# EasyEDA Pro project course_project_bulid.eprj

# Schematic Schematic1
Create Date: 2023-01-06; Page Name: P1; Project Name: course_project_bulid; Schematic Name: Schematic1; Update Date: 2023-01-06; Company: 嘉立创EDA; Page Size: A4; Version: V1.0
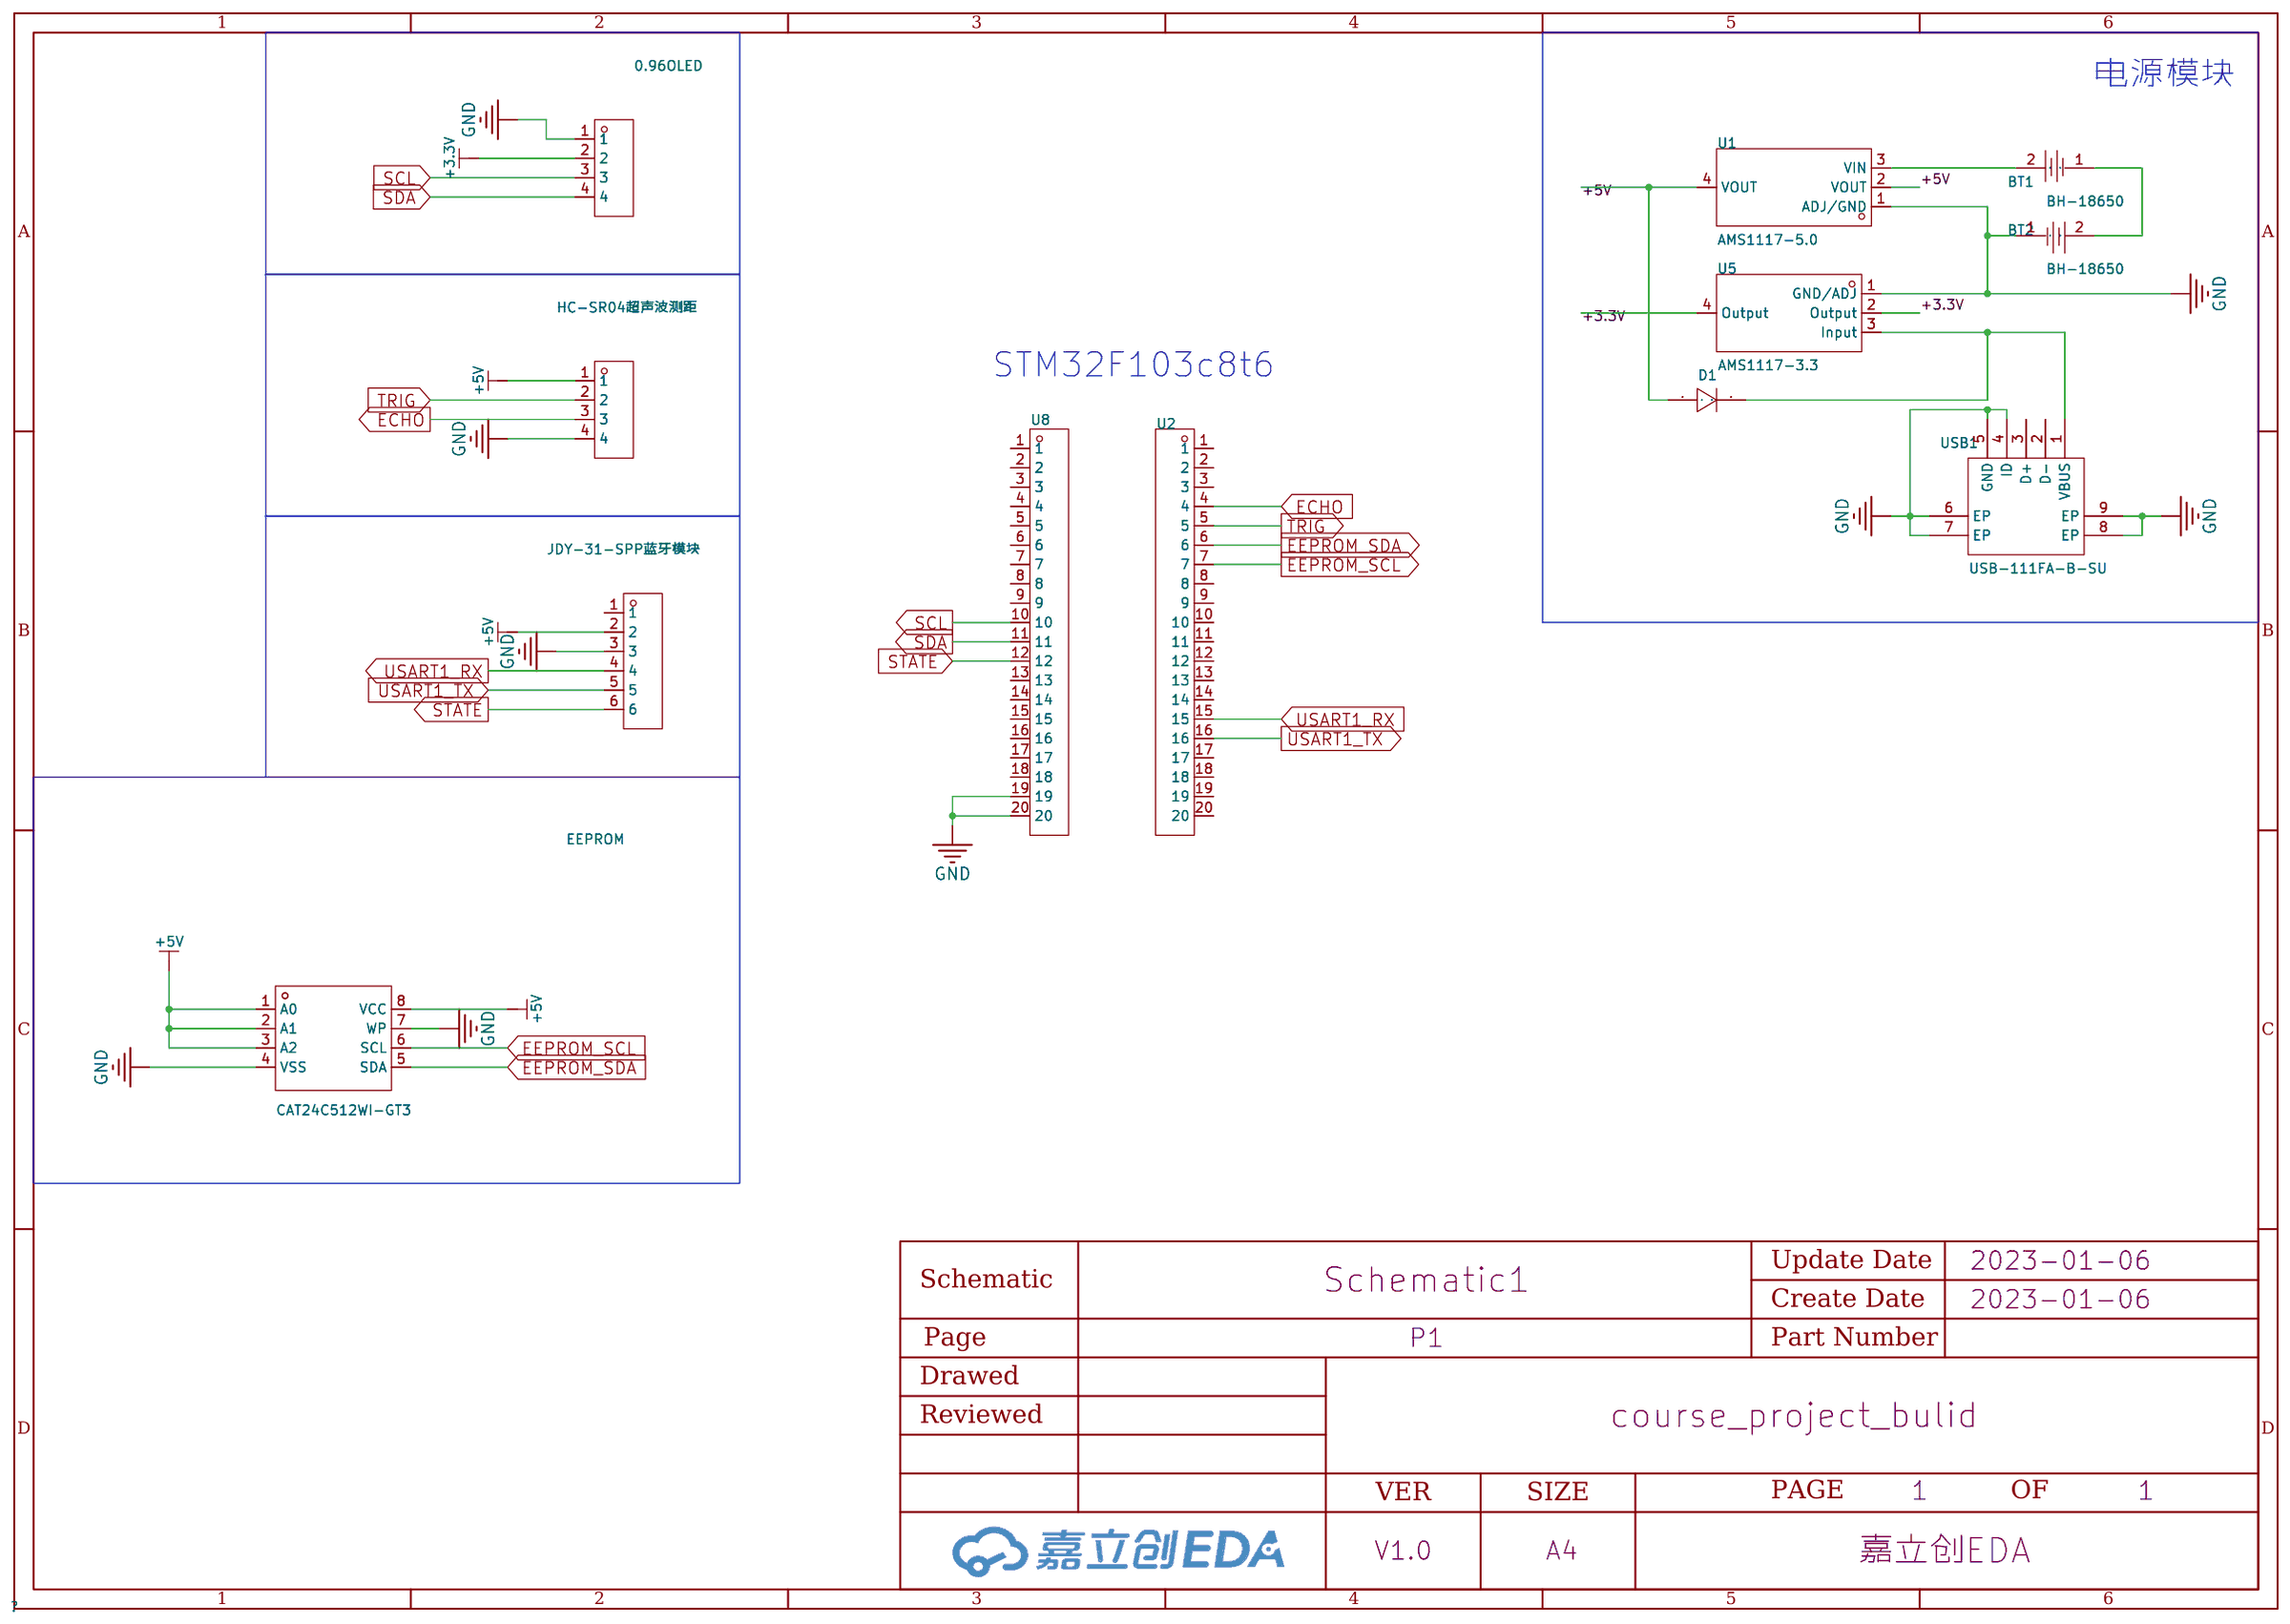
[diagram p0: schematic sheet]

## Parts
BT1  BH-18650  [BATTERY-SMD_18650-1S-L77.1-W20.7-1]
BT2  BH-18650  [BATTERY-SMD_18650-1S-L77.1-W20.7-1]
D1  1N4148WS  [SOD-323_L1.8-W1.3-LS2.5-RD]
EEPROM  CAT24C512WI-GT3  [SOIC-8_L4.9-W3.9-P1.27-LS6.0-BL]
HC-SR04超声波测距  PM254-1-04-W-8.5  [HDR-TH_4P-P2.54-H-F-W10.0-N]
JDY-31-SPP蓝牙模块  PM254-1-06-W-8.5  [HDR-TH_6P-P2.54-H-F-W10.0-N]
U1  AMS1117-5.0  [SOT-223-3_L6.5-W3.4-P2.30-LS7.0-BR]
U2  X5511FV-20-C30D97-0970  [HDR-TH_20P-P2.54-V-F]
U3  0.96OLED  [HDR-TH_4P-P2.54-V-F]
U5  AMS1117-3.3  [SOT-223-4_L6.5-W3.5-P2.30-LS7.0-BR]
U8  X5511FV-20-C30D97-0970  [HDR-TH_20P-P2.54-V-F]
USB1  USB-111FA-B-SU  [USB-SMD_USB-111FA-B-SU]

## Library data of the parts
BT1 BT2 = BH-18650-B1BA002: LCSC Part Name: 电池盒BH-18650; Supplier Part: C2988620; Manufacturer: MYOUNG(美阳); Supplier Footprint: SMD; JLCPCB Part Class: Extended Part; Datasheet: https://atta.szlcsc.com/upload/public/pdf/source/20220402/870DB99AB50CA0DF8D51CF7C86A51FAB.pdf; Supplier: LCSC
D1 = 1N4148WS_C2128: 二极管配置:独立式;功率:200mW;直流反向耐压(Vr):100V;平均整流电流(Io):150mA;正向压降(Vf):1.25V@150mA;反向电流(Ir):1uA@75V;反向恢复时间(trr):4ns;工作温度:+150℃@(Tj);; LCSC Part Name: 100V 150mA 4ns T4; Supplier Part: C2128; Manufacturer: CJ(江苏长电/长晶); Supplier Footprint: SOD-323; JLCPCB Part Class: Basic Part; Datasheet: https://atta.szlcsc.com/upload/public/pdf/source/20140809/1457707208178.pdf; Supplier: LCSC; Diode Configuration: 独立式; Power Dissipation: 200mW; Reverse Voltage (Vr): 100V; Average Rectified Current (Io): 150mA; Forward Voltage (Vf@If): 1.25V@150mA; Reverse Leakage Current: 1uA@75V; Reverse Recovery Time (trr): 4ns; Operating Temperature: +150℃@(Tj)
EEPROM = CAT24C512WI-GT3: CAT24C512 是一款 EEPROM 串行 512-Kb I2C，内部组织为 65,536 个词，每个词 8 位。它具有 128 字节页写入缓存，支持标准 (100 kHz)、快速 (400 kHz) 和超快 (1 MHz) I2C 协议。写入操作可通过将 WP 引脚置于高电平类禁止（这样会保护整个内存）。外部地址引脚使其能够在同一个总线上放置最多八个 CAT24C512 器件。片上 ECC（错误修正代码）使得该器件适用于高可靠性应用。; LCSC Part Name: EEPROM 串行 512-Kb I2C; Supplier Part: C79986; Manufacturer: onsemi(安森美); Supplier Footprint: SOIC-8; JLCPCB Part Class: Extended Part; Datasheet: https://atta.szlcsc.com/upload/public/pdf/source/20160729/1469779584598.PDF; Supplier: LCSC
HC-SR04超声波测距 = PM254-1-04-W-8.5: 间距:2.54mm;总孔位数:4;排数:1;插孔结构:1x4P;行距:-;安装类型:弯插;圆孔/方孔:方孔;额定电流:3A;额定电压:-;插孔方向:侧面;塑高:8.5mm;工作温度范围:-40℃~+105℃;; LCSC Part Name: 2.54mm 1x4P; Supplier Part: C2897386; Manufacturer: HCTL(华灿天禄); Supplier Footprint: 弯插,P=2.54mm; JLCPCB Part Class: Extended Part; Datasheet: https://atta.szlcsc.com/upload/public/pdf/source/20211019/10E5F374A8C70BEE256048F5DCDE14A3.pdf; Supplier: LCSC; Pitch: 2.54mm; Number of Holes: 4; Number of Rows: 1; Holes Structure: 1x4P; Mounting Type: 弯插; Circular Hole / Square Hole: 方孔; Current Rating (Max): 3A; Holes Direction: 侧面; Insulation Height: 8.5mm; Operating Temperature Range: -40℃~+105℃
JDY-31-SPP蓝牙模块 = PM254-1-06-W-8.5: 间距:2.54mm;总孔位数:6;排数:1;插孔结构:1x6P;行距:-;安装类型:弯插;圆孔/方孔:方孔;额定电流:3A;额定电压:-;插孔方向:侧面;塑高:8.5mm;工作温度范围:-40℃~+105℃;; LCSC Part Name: 2.54mm 1x6P; Supplier Part: C2897388; Manufacturer: HCTL(华灿天禄); Supplier Footprint: 弯插,P=2.54mm; JLCPCB Part Class: Extended Part; Datasheet: https://atta.szlcsc.com/upload/public/pdf/source/20211019/10E5F374A8C70BEE256048F5DCDE14A3.pdf; Supplier: LCSC; Pitch: 2.54mm; Number of Holes: 6; Number of Rows: 1; Holes Structure: 1x6P; Mounting Type: 弯插; Circular Hole / Square Hole: 方孔; Current Rating (Max): 3A; Holes Direction: 侧面; Insulation Height: 8.5mm; Operating Temperature Range: -40℃~+105℃
U1 = AMS1117-5.0_C2909825: 输出类型:固定;输出极性:正;输出通道数:1;最大输入电压:20V;输出电压:5V;压差:1.4V@1A;静态电流(地电流):5mA;输出电流:1A;电源纹波抑制比(PSRR):70dB@(120Hz);噪声:0.003%Vout;特性:大电流;工作温度:-40℃~+125℃@(Tj);; LCSC Part Name: 正 Vin=20V Vout=5V 1A 70dB@(120Hz); Supplier Part: C2909825; Manufacturer: WPMtek(维攀微); Supplier Footprint: SOT-223-3; JLCPCB Part Class: Extended Part; Datasheet: https://atta.szlcsc.com/upload/public/pdf/source/20211021/A68CA558078DAC4BBD2162BCADCC35AB.pdf; Supplier: LCSC; Output Type: 固定; Output Polarity: 正; Number of Outputs: 1; Maximum Input Voltage: 20V; Output Voltage: 5V; Dropout Voltage: 1.4V@1A; Quiescent Current (Ground Current): 5mA; Output Current: 1A; Power Supply Rejection Ratio (PSRR): 70dB@(120Hz); Noise: 0.003%Vout; Feature: 大电流; Operating Temperature: -40℃~+125℃@(Tj)
U2 U8 = X5511FV-20-C30D97-0970: 间距:2.54mm;总孔位数:20;排数:1;插孔结构:1x20P;行距:-;安装类型:直插;圆孔/方孔:圆孔;额定电流:-;额定电压:-;插孔方向:顶部;塑高:3mm;触头材质:黄铜;触头镀层:金;工作温度范围:-40℃~+105℃;焊接温度(最大值):260℃;; LCSC Part Name: 2.54mm 1x20P; Supplier Part: C2883486; Manufacturer: XKB Connectivity(中国星坤); Supplier Footprint: 直插,P=2.54mm; JLCPCB Part Class: 扩展库; Datasheet: https://atta.szlcsc.com/upload/public/pdf/source/20211009/43EC1C49F931A7FEC57CD081BD1C4E7E.pdf; Supplier: LCSC; Pitch: 2.54mm; Number of Holes: 20; Number of Rows: 1; Holes Structure: 1x20P; Mounting Type: 直插; Circular Hole / Square Hole: 圆孔; Holes Direction: 顶部; Insulation Height: 3mm; Contact Material: 黄铜; Contact Plating: 金; Operating Temperature Range: -40℃~+105℃; Welding Temperature (Max): 260℃
U3 = A2541HWV-4P_C5176037: LCSC Part Name: A2541HWV-4P; Supplier Part: C5176037; Manufacturer: CJT(长江连接器); Supplier Footprint: 插件,P=2.54mm; Datasheet: https://atta.szlcsc.com/upload/public/pdf/source/20220916/7A4096DE70FDAC144DF90D6CBDE9C2A1.pdf; Supplier: LCSC
U5 = AMS1117-3.3_C369933: 输出类型:固定;输出极性:正;输出通道数:1;最大输入电压:18V;输出电压:3.3V;压差:1.3V@800mA;静态电流(地电流):8mA;输出电流:1A;电源纹波抑制比(PSRR):-;噪声:-;特性:-;工作温度:-;; LCSC Part Name: 正 Vin=18V Vout=3.3V 1A; Supplier Part: C369933; Manufacturer: KEXIN(科信); Supplier Footprint: SOT-223-4; JLCPCB Part Class: Extended Part; Datasheet: https://atta.szlcsc.com/upload/public/pdf/source/20190724/C369933_94137CB0CFA8D6ABD8E5DA714A2C2C4B.pdf; Supplier: LCSC; Output Type: 固定; Output Polarity: 正; Number of Outputs: 1; Maximum Input Voltage: 18V; Output Voltage: 3.3V; Dropout Voltage: 1.3V@800mA; Quiescent Current (Ground Current): 8mA; Output Current: 1A
USB1 = USB-111FA-B-SU: mirco usb连接器 USB-111FA-B-SU B型 5.06*7.5*2; LCSC Part Name: mirco usb连接器 USB-111FA-B-SU B型; Supplier Part: C2939563; Manufacturer: HOOYA(皓宇电子); Supplier Footprint: SMD; JLCPCB Part Class: Extended Part; Datasheet: https://atta.szlcsc.com/upload/public/pdf/source/20220630/60F22B42DF33373B1A3EDB36B58A5589.pdf; Supplier: LCSC

## Nets
+3.3V: U3.2 U5.2(Output) U5.4(Output)
+5V: D1.2(A) EEPROM.1(A0) EEPROM.2(A1) EEPROM.3(A2) EEPROM.8(VCC) HC-SR04超声波测距.1 JDY-31-SPP蓝牙模块.2 U1.2(VOUT) U1.4(VOUT)
GND: BT2.1 EEPROM.4(VSS) EEPROM.7(WP) HC-SR04超声波测距.4 JDY-31-SPP蓝牙模块.3 U1.1(ADJ/GND) U3.1 U5.1(GND/ADJ) U8.19 U8.20 USB1.4(ID) USB1.5(GND) USB1.6(EP) USB1.7(EP) USB1.8(EP) USB1.9(EP)
ECHO: HC-SR04超声波测距.3 U2.4
EEPROM_SCL: EEPROM.6(SCL) U2.7
EEPROM_SDA: EEPROM.5(SDA) U2.6
SCL: U3.3 U8.10
SDA: U3.4 U8.11
STATE: JDY-31-SPP蓝牙模块.6 U8.12
TRIG: HC-SR04超声波测距.2 U2.5
USART1_RX: JDY-31-SPP蓝牙模块.4 U2.15
USART1_TX: JDY-31-SPP蓝牙模块.5 U2.16
$1N3554: BT1.1 BT2.2
Net-(BT1-2): BT1.2 U1.3(VIN)
Net-(D1-1): D1.1(K) U5.3(Input) USB1.1(VBUS)

Not connected (* = marked no-connect by the designer): JDY-31-SPP蓝牙模块 1; U2 1 2 3 8 9 10 11 12 13 14 17 18 19 20; U8 1 2 3 4 5 6 7 8 9 13 14 15 16 17 18; USB1 2(D-) 3(D+)

## Notes on the sheet
- 电源模块
- STM32F103c8t6

# Board PCB1
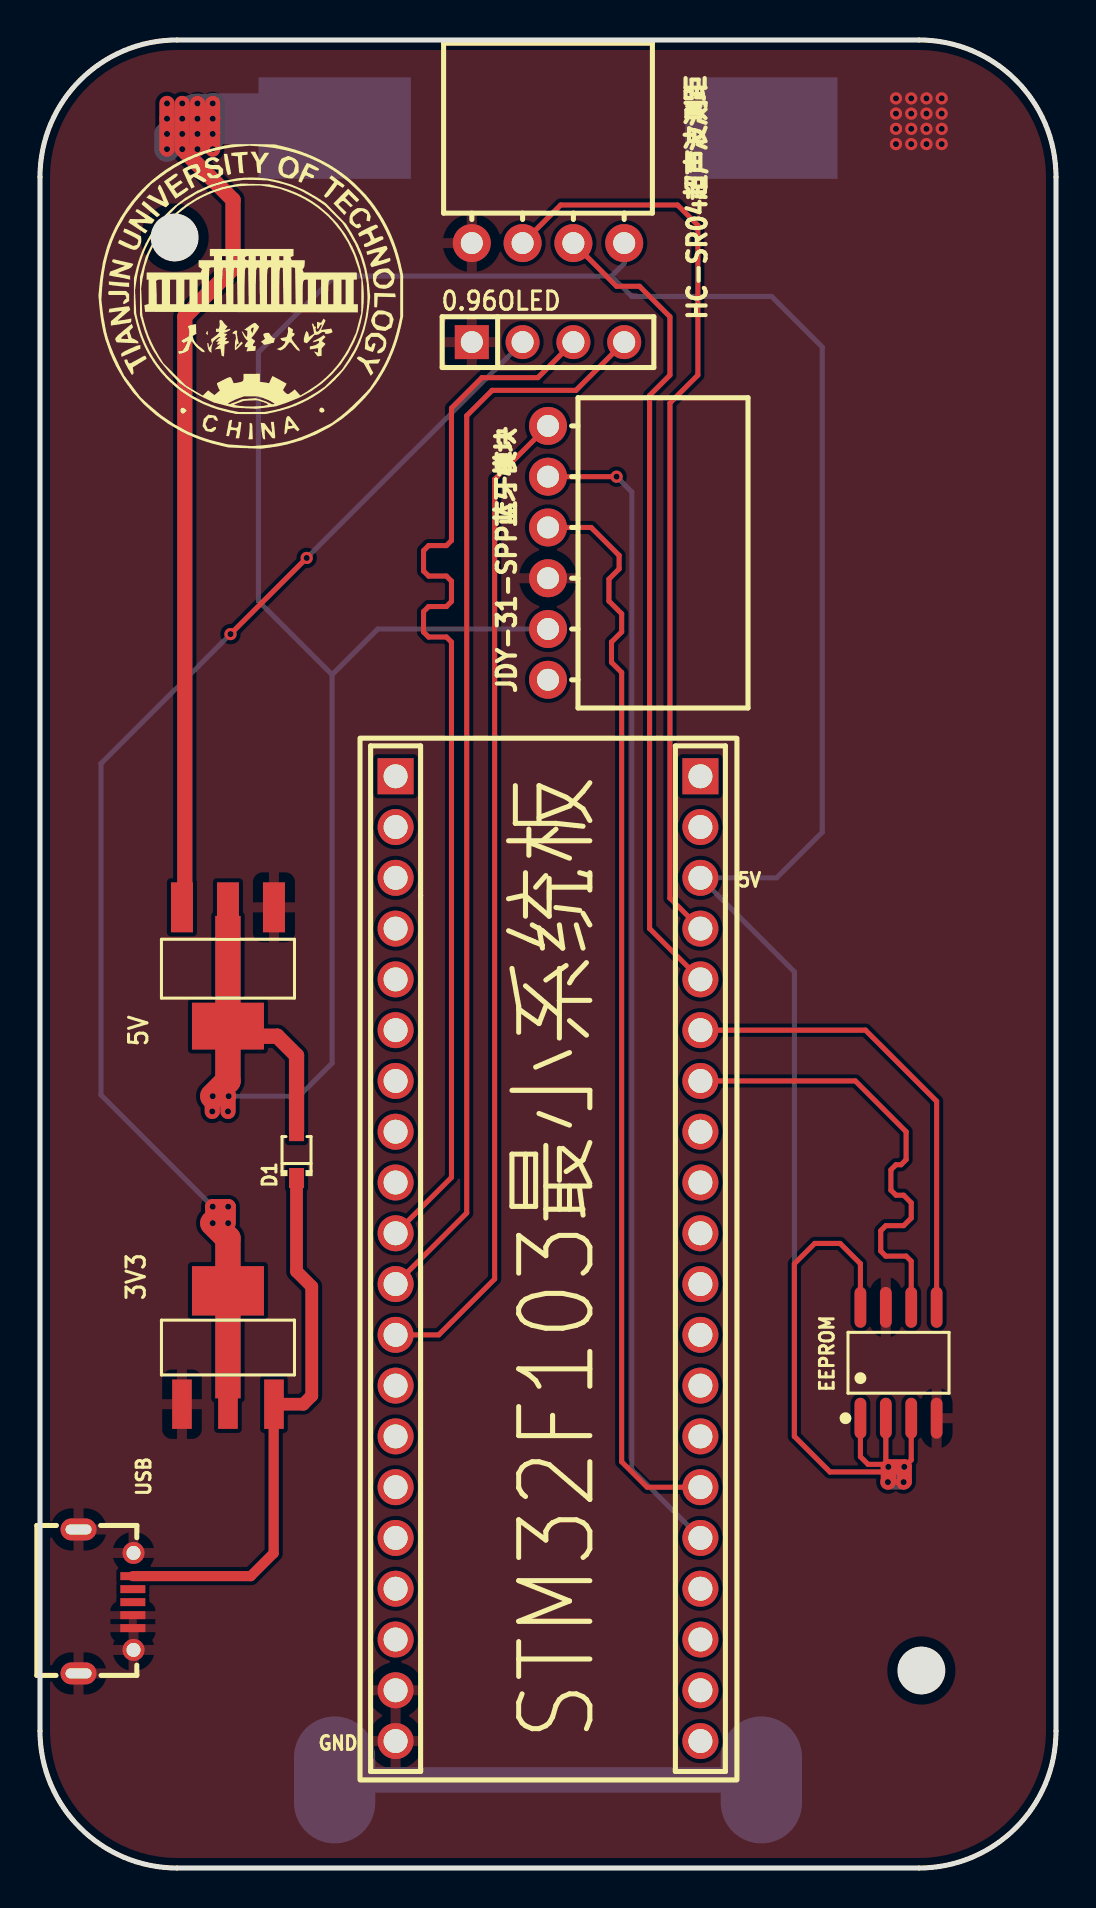
[diagram p1: board, top side]
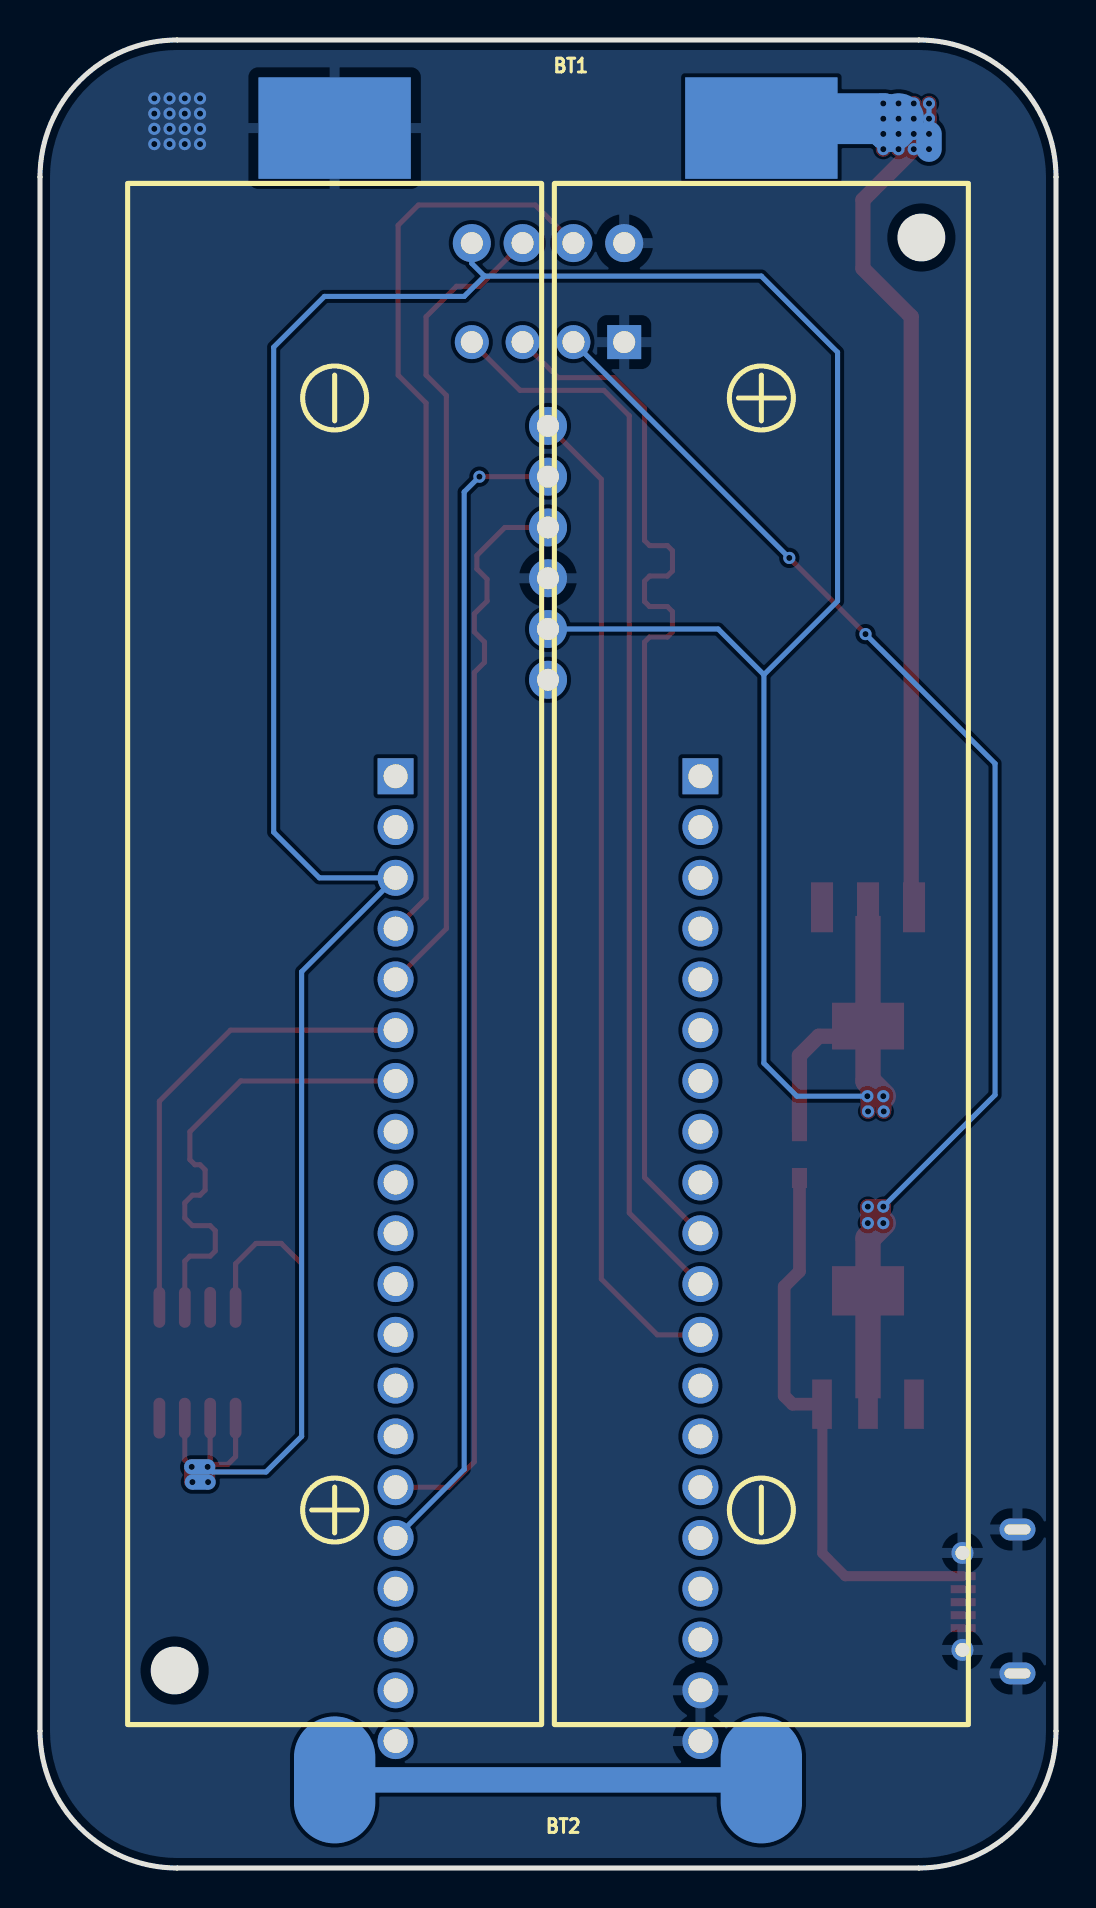
[diagram p2: board, bottom side, seen from below]

Outline 50.8 x 91.44 mm; copper layers: Top Layer, Bottom Layer. Coordinates in mm from the lower left corner of the outline.
Outline path: 0,84.58 0,6.86 arc(2.01,2.01) 6.86,0 43.94,0 arc(48.79,2.01) 50.8,6.86 50.8,84.58 arc(48.79,89.43) 43.94,91.44 6.86,91.44 arc(2.01,89.43) 0,84.58
Stack: Top Layer 0.035mm / Dielectric1 1.51mm FR4 er 4.5 / Bottom Layer 0.035mm

## Design rules (mm)
spacing safeClearance (default): track to track 0.152, other pairs 0.152 to 0.3
track width trackWidth (default): min 0.127, default 0.254, max 2.54
differential pair differentialPair (default): width min 0.127, default 0.254, max 2.54; gap min 0.152, default 0.152
via viaSize (default): diameter min 0.5, default 0.61, max 10; hole min 0.3, default 0.305, max 6

## Placement (name value [footprint] x y rotation side)
0.96OLED  0.96OLED  [HDR-TH_4P-P2.54-V-F]  25.4 76.33 0 top
3V3  AMS1117-3.3  [SOT-223-4_L6.5-W3.5-P2.30-LS7.0-BR]  9.4 26.03 270 top
5V  -  [HDR-TH_20P-P2.54-V-F]  33.02 30.48 270 top
5V#2  -  [SOT-223-3_L6.5-W3.4-P2.30-LS7.0-BR]  9.4 45.08 90 top
BT1  BH-18650  [BATTERY-SMD_18650-1S-L77.1-W20.7-1]  14.73 45.72 180 bottom
BT2  BH-18650  [BATTERY-SMD_18650-1S-L77.1-W20.7-1#2]  36.07 45.72 0 bottom
D1  1N4148WS  [SOD-323_L1.8-W1.3-LS2.5-RD]  12.83 35.69 90 top
EEPROM  CAT24C512WI-GT3  [SOIC-8_L4.9-W3.9-P1.27-LS6.0-BL]  42.93 25.27 0 top
GND  X5511FV-20-C30D97-0970  [HDR-TH_20P-P2.54-V-F]  17.78 30.48 270 top
HC-SR04超声波测距  PM254-1-04-W-8.5  [HDR-TH_4P-P2.54-H-F-W10.0-N]  25.4 81.28 180 top
JDY-31-SPP蓝牙模块  PM254-1-06-W-8.5  [HDR-TH_6P-P2.54-H-F-W10.0-N]  25.4 65.79 90 top
NOREF  -  [Pad_e766]  9.4 45.08 90 top
NOREF#2  -  [Pad_e758]  9.4 26.03 90 top
USB  USB-111FA-B-SU  [USB-SMD_USB-111FA-B-SU]  3.3 13.34 270 top

## Footprints (pads in the part's own frame, mm; a bottom-side part is the same pattern mirrored in y, then rotated)
BATTERY-SMD_18650-1S-L77.1-W20.7-1
  oval 4.064x6.35 smd: 1(0,-41.313)
  rect 7.62x5.08 smd: 2(0,41.313)
BATTERY-SMD_18650-1S-L77.1-W20.7-1#2
  rect 7.62x5.08 smd: 1(0,-41.313)
  oval 4.064x6.35 smd: 2(0,41.313)
HDR-TH_4P-P2.54-H-F-W10.0-N
  round 1.9 hole 1.1: 1(-3.81,0) 2(-1.27,0) 3(1.27,0) 4(3.81,0)
HDR-TH_4P-P2.54-V-F
  rect 1.7x1.7 hole 1.1: 1(-3.81,0)
  round 1.7 hole 1.1: 2(-1.27,0) 3(1.27,0) 4(3.81,0)
HDR-TH_6P-P2.54-H-F-W10.0-N
  round 1.9 hole 1.1: 1(-6.35,0) 2(-3.81,0) 3(-1.27,0) 4(1.27,0) 5(3.81,0) 6(6.35,0)
HDR-TH_20P-P2.54-V-F
  rect 1.8x1.8 hole 1.2: 1(-24.13,0)
  round 1.8 hole 1.2: 2(-21.59,0) 3(-19.05,0) 4(-16.51,0) 5(-13.97,0) 6(-11.43,0) 7(-8.89,0) 8(-6.35,0) 9(-3.81,0) 10(-1.27,0) 11(1.27,0) 12(3.81,0) 13(6.35,0) 14(8.89,0) 15(11.43,0) 16(13.97,0) 17(16.51,0) 18(19.05,0) 19(21.59,0) 20(24.13,0)
Pad_e758
  rect 5.08x1.27 smd: 1(0,0)
Pad_e766
  rect 5.08x1.27 smd: 1(0,0)
SOD-323_L1.8-W1.3-LS2.5-RD
  rect 1x0.75 smd: 1(-1.173,0) 2(1.173,0)
SOIC-8_L4.9-W3.9-P1.27-LS6.0-BL
  oval 0.588x2.045 smd: 1(-1.905,-2.772) 2(-0.635,-2.772) 3(0.635,-2.772) 4(1.905,-2.772) 5(1.905,2.772) 6(0.635,2.772) 7(-0.635,2.772) 8(-1.905,2.772)
SOT-223-3_L6.5-W3.4-P2.30-LS7.0-BR
  rect 2.5x1.1 smd: 1(2.97,-2.3) 2(2.97,0) 3(2.97,2.3)
  rect 2.34x3.6 smd: 4(-2.97,0)
SOT-223-4_L6.5-W3.5-P2.30-LS7.0-BR
  rect 2.47x0.98 smd: 1(2.835,-2.3) 2(2.835,0) 3(2.835,2.3)
  rect 2.47x3.6 smd: 4(-2.835,0)
USB-SMD_USB-111FA-B-SU
  rect 0.4x1.25 smd: 1(-1.265,1.339) 2(-0.615,1.339) 3(0.035,1.339) 4(0.686,1.339) 5(1.336,1.339)
  round 1.1 hole 0.7: 6(2.425,1.375) 7(-2.425,1.375)
  oval 1.1x1.8 hole 0.5x1.3: 8(3.6,-1.375) 9(-3.6,-1.375)

## Nets
+3.3V: 0.96OLED.2 3V3.2 3V3.4 NOREF#2.1
+5V: 5V.3 5V#2.2 5V#2.4 D1.2 EEPROM.1 EEPROM.2 EEPROM.3 EEPROM.8 HC-SR04超声波测距.1 JDY-31-SPP蓝牙模块.2 NOREF.1
GND: 0.96OLED.1 3V3.1 5V#2.1 BT2.1 EEPROM.4 EEPROM.7 GND.19 GND.20 HC-SR04超声波测距.4 JDY-31-SPP蓝牙模块.3 USB.4 USB.5 USB.6 USB.7 USB.8 USB.9
ECHO: 5V.4 HC-SR04超声波测距.3
EEPROM_SCL: 5V.7 EEPROM.6
EEPROM_SDA: 5V.6 EEPROM.5
POW18650: 5V#2.3 BT1.2
POWUSB: 3V3.3 D1.1 USB.1
SCL: 0.96OLED.3 GND.10
SDA: 0.96OLED.4 GND.11
STATE: GND.12 JDY-31-SPP蓝牙模块.6
TRIG: 5V.5 HC-SR04超声波测距.2
USART1_RX: 5V.15 JDY-31-SPP蓝牙模块.4
USART1_TX: 5V.16 JDY-31-SPP蓝牙模块.5
$1N3554: BT1.1 BT2.2

Pads without a net: 5V 1 2 8 9 10 11 12 13 14 17 18 19 20; GND 1 2 3 4 5 6 7 8 9 13 14 15 16 17 18; JDY-31-SPP蓝牙模块 1; USB 2 3

## Via types
v1: diameter 0.61, hole 0.305, Top Layer to Bottom Layer, 47 vias

## Routing (per net, layer and track width the routed paths; a pad name or vN(x,y) marks a point on that pad's centre or on a via; arc(x,y) is an arc through that point)
+3.3V: length 60.4
  Top Layer w0.254: v1(9.53,61.72) v1(13.34,65.53)
  Top Layer w0.762: v1(9.41,32.26) v1(9.41,33.08) v1(8.64,33.08) v1(8.64,32.26)
  Top Layer w1.27: 3V3.4 9.4,31.5 v1(8.64,32.26)
  Bottom Layer w0.254: v1(13.34,65.53) 0.96OLED.2 ; v1(8.64,33.08) 3.05,38.67 3.05,55.25 v1(9.53,61.72)
+5V: length 201.4
  Top Layer w0.254: v1(43.21,20.07) 43.56,20.41 EEPROM.3 ; 42.29,20.19 41.4,20.19 41.02,20.57 EEPROM.1 ; 42.29,20.19 EEPROM.2 ; 42.29,20.19 v1(42.42,20.07) 42.16,19.81 39.5,19.81 37.72,21.59 37.72,30.23 38.74,31.24 40,31.24 41.02,30.23 EEPROM.8
  Top Layer w0.762: D1.2 12.83,40.64 11.86,41.61 9.91,41.61 5V#2.4 ; v1(42.4,19.3) 42.42,19.33 v1(42.42,20.07) v1(43.21,20.07) 43.21,19.34 v1(43.18,19.3) ; v1(9.4,37.85) 9.4,38.57 v1(9.43,38.61) v1(8.64,38.61) ; v1(8.61,37.85) 8.61,38.59
  Top Layer w1.27: 5V#2.4 9.4,39.37 v1(8.64,38.61)
  Bottom Layer w0.254: 14.6,59.69 16.89,61.98 JDY-31-SPP蓝牙模块.2 ; 14.6,59.69 14.6,40.26 12.95,38.61 v1(9.43,38.61) ; 14.6,59.69 10.92,63.37 10.92,75.82 14.73,79.63 28.57,79.63 ; v1(42.42,20.07) 42.16,19.81 39.5,19.81 37.72,21.59 37.72,44.83 5V.3 36.83,49.53 39.12,51.82 39.12,76.07 36.58,78.61 29.59,78.61 28.57,79.63 ; 28.57,79.63 29.21,80.26 HC-SR04超声波测距.1
  Bottom Layer w0.762: v1(42.42,20.07) v1(43.21,20.07) ; v1(42.4,19.3) v1(43.18,19.3)
GND:
  vias: v1(42.8,88.52) v1(42.8,87.76) v1(42.8,87) v1(42.8,86.23) v1(43.56,88.52) v1(43.56,87.76) v1(43.56,87) v1(43.56,86.23) v1(44.32,88.52) v1(44.32,87.76) v1(44.32,87) v1(44.32,86.23) v1(45.09,88.52) v1(45.09,87.76) v1(45.09,87) v1(45.09,86.23)
ECHO: length 46.4
  Top Layer w0.254: HC-SR04超声波测距.3 26.03,83.19 31.88,83.19 32.89,82.17 32.89,74.68 31.5,73.28 31.5,48.51 5V.4
EEPROM_SCL: length 23.6
  Top Layer w0.254: EEPROM.6 43.56,30.35 43.31,30.61 42.29,30.61 42.04,30.86 42.04,31.88 42.29,32.13 43.18,32.13 43.56,32.51 43.56,33.27 43.18,33.66 42.8,33.66 42.54,33.91 42.54,34.92 42.8,35.18 43.05,35.18 43.31,35.43 43.31,36.83 40.77,39.37 5V.7
EEPROM_SDA: length 23.6
  Top Layer w0.254: 5V.6 41.28,41.91 44.83,38.35 EEPROM.5
POW18650: length 58.8
  Top Layer w0.762: v1(7.87,85.98) v1(7.87,86.74) v1(7.87,87.5) v1(7.87,88.27) ; v1(7.11,88.27) v1(7.11,87.5) v1(7.11,86.74) v1(7.11,85.98) 9.65,83.44 9.65,80.01 7.24,77.6 7.24,48.2 5V#2.3 ; v1(6.35,85.98) v1(6.35,86.74) v1(6.35,87.5) v1(6.35,88.27) ; v1(8.64,85.98) v1(8.64,86.74) v1(8.64,87.5) v1(8.64,88.27)
  Bottom Layer w0.254: v1(6.35,88.27) v1(6.35,87.5) v1(6.35,86.74)
  Bottom Layer w1.27: v1(6.35,86.74) v1(6.35,85.98)
  Bottom Layer w2.54: v1(7.87,87.5) 8.25,87.12 v1(8.64,87.5) 14.26,87.5 BT1.2
POWUSB: length 28.3
  Top Layer w0.508: 3V3.3 11.68,23.19 11.68,15.75 10.54,14.6 USB.1
  Top Layer w0.635: 12.83,34.54 12.83,29.84 13.59,29.08 13.59,23.62 13.17,23.2 3V3.3
SCL: length 54.3
  Top Layer w0.254: 0.96OLED.3 24.89,74.55 22.1,74.55 20.57,73.02 20.57,66.4 20.32,66.15 19.43,66.15 19.18,65.89 19.18,64.88 19.43,64.62 20.32,64.62 20.57,64.37 20.57,63.35 20.32,63.1 19.43,63.1 19.18,62.85 19.18,61.83 19.43,61.58 20.32,61.58 20.57,61.32 20.57,34.54 GND.10
SDA: length 54.3
  Top Layer w0.254: GND.11 21.34,32.77 21.34,72.64 22.61,73.91 26.8,73.91 0.96OLED.4
STATE: length 49.9
  Top Layer w0.254: JDY-31-SPP蓝牙模块.6 22.73,69.47 22.73,29.46 19.94,26.67 GND.12
TRIG: length 41
  Top Layer w0.254: HC-SR04超声波测距.2 28.83,79.12 29.97,79.12 31.5,77.6 31.5,74.68 30.48,73.66 30.48,46.99 5V.5
USART1_RX: length 54.8
  Top Layer w0.254: 5V.15 30.35,19.05 29.08,20.32 29.08,59.8 28.57,60.31 28.57,61.33 29.08,61.83 29.08,62.74 28.45,63.37 28.45,64.47 28.96,64.98 28.96,65.66 27.56,67.06 JDY-31-SPP蓝牙模块.4
USART1_TX: length 58.3
  Top Layer w0.254: v1(28.83,69.6) JDY-31-SPP蓝牙模块.5
  Bottom Layer w0.254: v1(28.83,69.6) 29.59,68.83 29.59,19.94 5V.16
$1N3554: length 21.3
  Bottom Layer w1.27: 14.73,4.41 36.07,4.41

## Copper pours and planes (outline as drawn; the poured copper is in the pictures)
GND on Top Layer: -19.56,93.6 60.58,93.6 60.58,-9.27 -19.56,-9.27
GND on Bottom Layer: -4.32,104.39 63.12,104.39 63.12,-4.19 -4.32,-4.19

## Text on the board
Top Silkscreen Layer: STM32F103最小系统板
